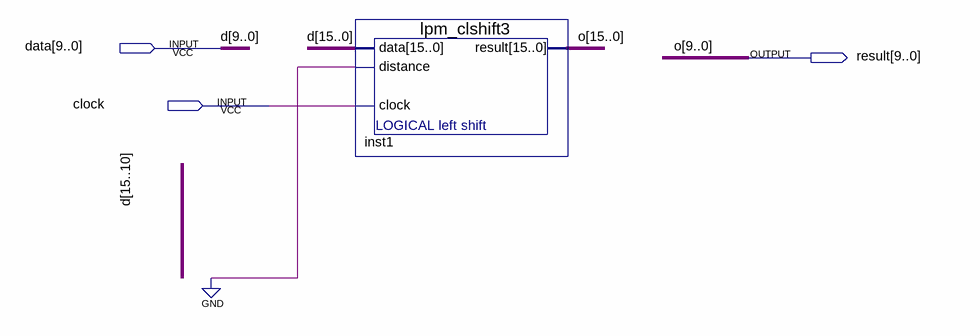
[diagram p0: schematic sheet]
// Quartus schematic 10bitreg.bdf as structural Verilog: 1 symbols, 3 pins
module \10bitreg  (
  input  [9:0] data,
  input  clock,
  output [9:0] result
);

  wire [15:10] d, o;

  lpm_clshift3 inst1 (.data({d, data}), .distance(1'b0), .clock(clock), .result({o, result}));

  // Other names for the same wires on the sheet: d[9:0] = data; o[9:0] = result
endmodule
